# EAGLE schematic apo_board (EAGLE 6.3)
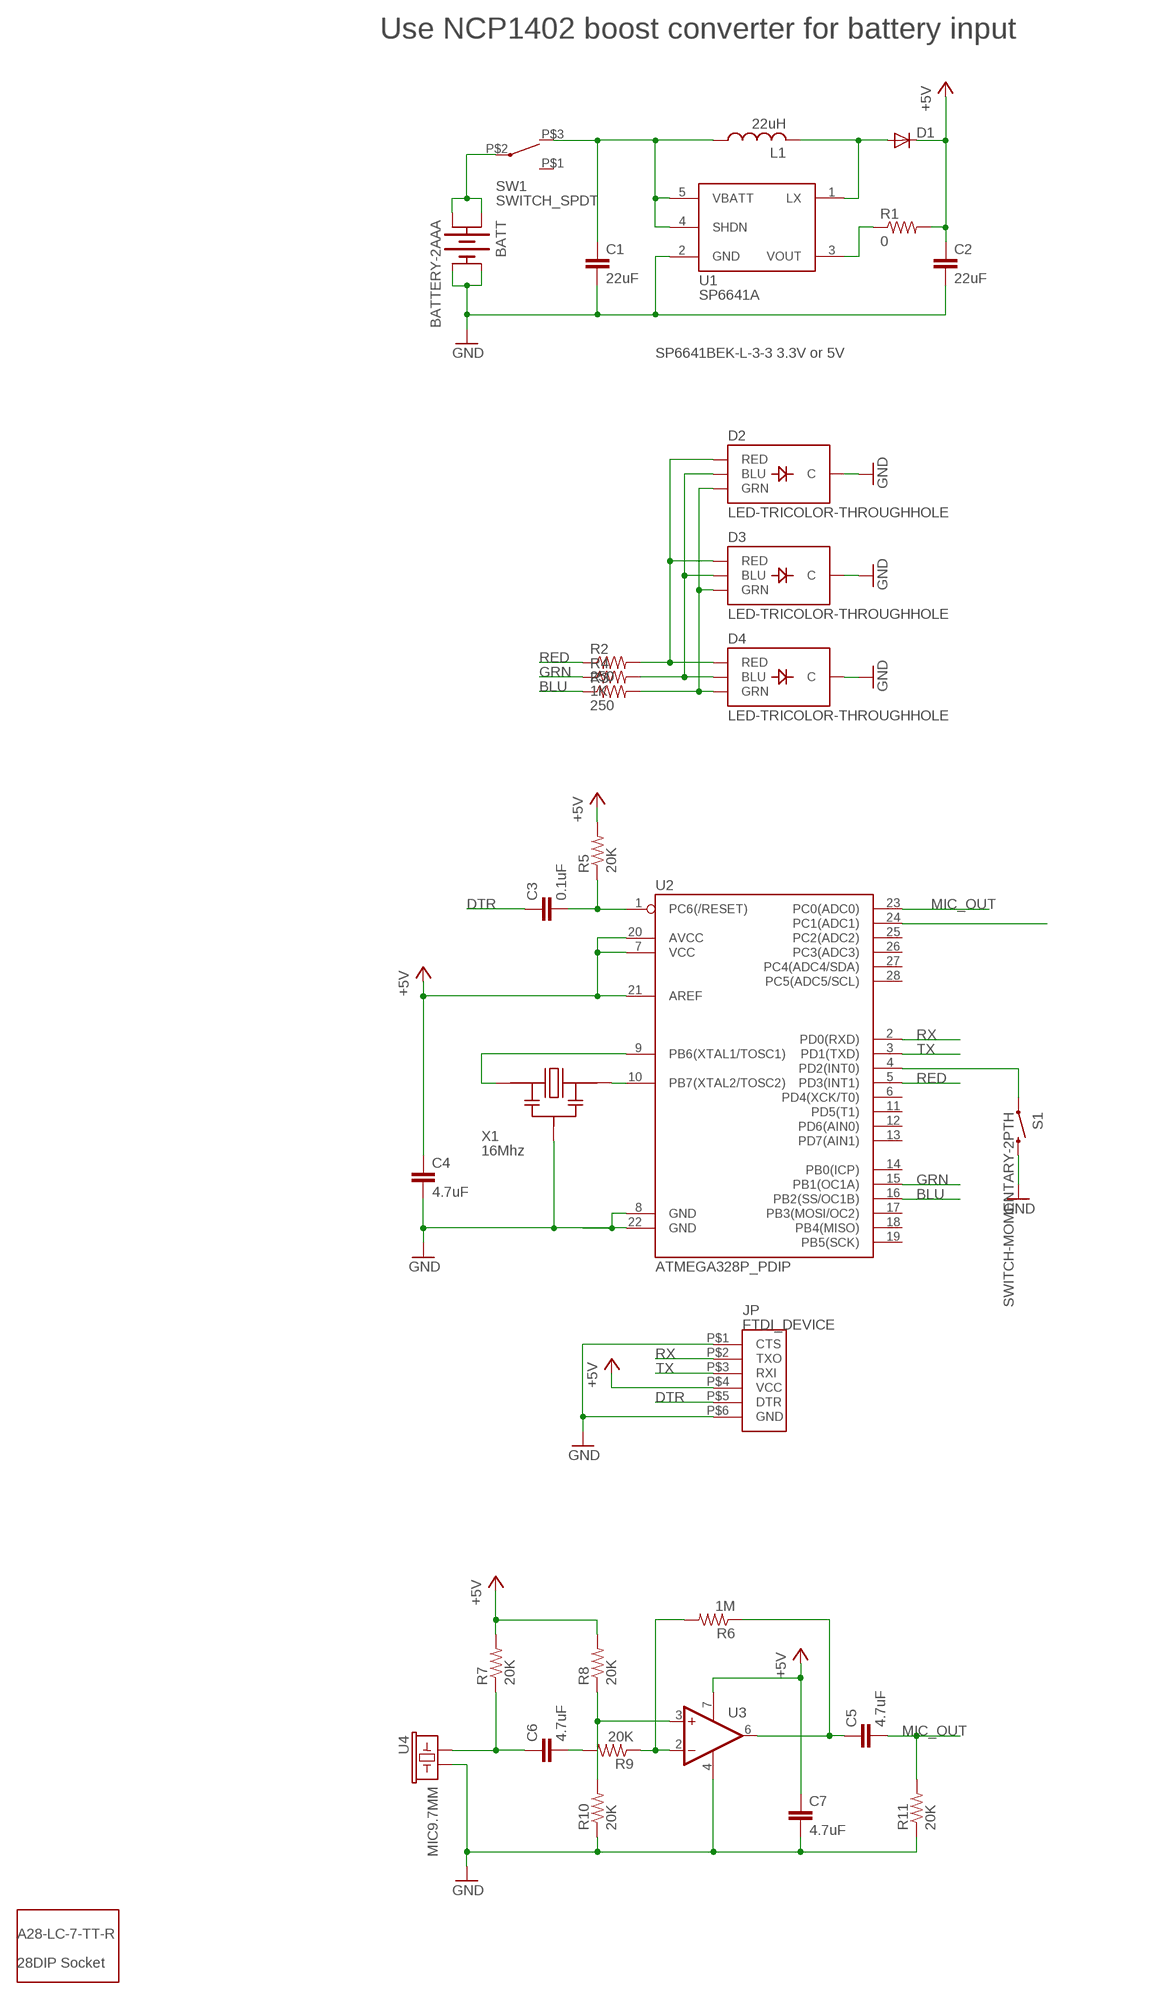
[diagram p0: schematic, sheet 1]

## Parts
BATT  BATTERY-2AAA  [BATTERY-AAA]
C1  22uF  CAPKIT  [CAP-PTH-SMALL-KIT]
C2  22uF  CAPKIT  [CAP-PTH-SMALL-KIT]
C3  0.1uF  CAPKIT  [CAP-PTH-SMALL-KIT]
C4  4.7uF  CAPKIT  [CAP-PTH-SMALL-KIT]
C5  4.7uF  CAPKIT  [CAP-PTH-SMALL-KIT]
C6  4.7uF  CAPKIT  [CAP-PTH-SMALL-KIT]
C7  4.7uF  CAPKIT  [CAP-PTH-SMALL-KIT]
D1  DIODE1N4148  [DIODE-1N4148]
D2  LED-TRICOLOR-THROUGHHOLE  [LED-TRICOLOR-THROUGHHOLE]
D3  LED-TRICOLOR-THROUGHHOLE  [LED-TRICOLOR-THROUGHHOLE]
D4  LED-TRICOLOR-THROUGHHOLE  [LED-TRICOLOR-THROUGHHOLE]
JP  FTDI_DEVICE  [FTDI_DEVICE_SIDE]
L1  22uH  INDUCTORAIUR-02H  [INDUCTOR_AIUR-02H]
R1  0  RESISTORAXIAL-0.3  [AXIAL-0.3]
R2  250  RESISTORAXIAL-0.3  [AXIAL-0.3]
R3  250  RESISTORAXIAL-0.3  [AXIAL-0.3]
R4  1K  RESISTORAXIAL-0.3  [AXIAL-0.3]
R5  20K  RESISTORAXIAL-0.3  [AXIAL-0.3]
R6  1M  RESISTORAXIAL-0.3  [AXIAL-0.3]
R7  20K  RESISTORAXIAL-0.3  [AXIAL-0.3]
R8  20K  RESISTORAXIAL-0.3  [AXIAL-0.3]
R9  20K  RESISTORAXIAL-0.3  [AXIAL-0.3]
R10  20K  RESISTORAXIAL-0.3  [AXIAL-0.3]
R11  20K  RESISTORAXIAL-0.3  [AXIAL-0.3]
S1  SWITCH-MOMENTARY-2PTH  [TACTILE-PTH]
SW1  SWITCH_SPDT  [SWITCH_SPDT_OS102011MA1QN1C]
U1  SP6641A  [SOT23-5]
U2  ATMEGA328P_PDIP  [DIL28-3]
U3  1AMP_P7+4N  [DIL08]
U4  MIC9.7MM  [MIC-9.7MM]
X1  16Mhz  CERAMIC_RESONATOR  [CERAMIC_RESONATOR_ZTT]

## Nets
+5V: C2.1 C4.1 C7.1 D1.C JP.P$4(VCC) R1.P$2 R5.P$2 R7.P$2 R8.P$2 U2.7(VCC) U2.20(AVCC) U2.21(AREF) U3.7(V+)
BATT: BATT.PWR@1(+1) BATT.PWR@2(+2) SW1.P$2(COMMON)
BLU: R3.P$1 U2.16(PB2(SS/OC1B))
DTR: C3.1 JP.P$5(DTR)
GND: BATT.GND@1(-1) BATT.GND@2(-2) C1.2 C2.2 C4.2 C7.2 D2.GND(C) D3.GND(C) D4.GND(C) JP.P$1(CTS) JP.P$6(GND) R10.P$1 R11.P$1 S1.3 U1.2(GND) U2.8(GND) U2.22(GND) U3.4(V-) U4.2 X1.P$2
GRN: R4.P$1 U2.15(PB1(OC1A))
MIC_OUT: C5.2 R11.P$2 U2.23(PC0(ADC0))
N$1: U2.9(PB6(XTAL1/TOSC1)) X1.P$1
N$2: U2.10(PB7(XTAL2/TOSC2)) X1.P$3
N$3: S1.1 U2.4(PD2(INT0))
N$4: C6.2 R9.P$2
N$5: R8.P$1 R10.P$2 U3.3(+IN)
N$6: R6.P$2 R9.P$1 U3.2(-IN)
N$7: C6.1 R7.P$1 U4.1
N$8: D2.GRN D3.GRN D4.GRN R3.P$2
N$9: D2.BLU D3.BLU D4.BLU R4.P$2
N$10: C3.2 R5.P$1 U2.1(PC6(/RESET))
N$11: C5.1 R6.P$1 U3.6(OUT)
N$12: U2.24(PC1(ADC1))
N$13: D2.RED D3.RED D4.RED R2.P$2
N$14: D1.A L1.P$2 U1.1(LX)
N$16: C1.1 L1.P$1 SW1.P$3 U1.4(SHDN) U1.5(VBATT)
N$17: R1.P$1 U1.3(VOUT)
RED: R2.P$1 U2.5(PD3(INT1))
RX: JP.P$2(TXO) U2.2(PD0(RXD))
TX: JP.P$3(RXI) U2.3(PD1(TXD))
Unconnected: SW1.P$1 U2.6(PD4(XCK/T0)) U2.11(PD5(T1)) U2.12(PD6(AIN0)) U2.13(PD7(AIN1)) U2.14(PB0(ICP)) U2.17(PB3(MOSI/OC2)) U2.18(PB4(MISO)) U2.19(PB5(SCK)) U2.25(PC2(ADC2)) U2.26(PC3(ADC3)) U2.27(PC4(ADC4/SDA)) U2.28(PC5(ADC5/SCL))

## Notes on the sheet
- Use NCP1402 boost converter for battery input
- SP6641BEK-L-3-3 3.3V or 5V

## Library data of the parts
BATT = SparkFun-Electromechanical:BATTERY-2: AA and AAA battery holders
C1-C7 = SparkFun-Passives:CAP: Capacitor Standard 0603 ceramic capacitor, and 0.1" leaded capacitor.
D1 = SparkFun-DiscreteSemi:DIODE: Diode These are standard reverse protection diodes and small signal diodes. SMA package can handle up to about 1A. SOD-323 can handle about 200mA. What the SOD-323 package when ordering, there are some mfgs out there that are 5-pin packages.
D2-D4 = SparkFun:LED-TRICOLOR-THROUGHHOLE
JP = SparkFun-Connectors:FTDI_DEVICE: Connector which mates to FTDI basic or FTDI cable.
L1 = 1_Dan Master:INDUCTOR: SMT Inductor
R1-R11 = SparkFun-Passives:RESISTOR: Resistor Basic schematic elements and footprints for 0603, 1206, and PTH resistors.
S1 = SparkFun:SWITCH-MOMENTARY-2
SW1 = 1_Dan Master:SWITCH_SPDT
U1 = 1_Dan Master:SP6641A
U2 = SparkFun-DigitalIC:ATMEGA328P_PDIP: uC used in the Arduino 32kb flash, 1k EEPROM, 2k SRAM This is the through-hole version of this chip.
U3 = linear:1AMP_P7+4: OP AMP
U4 = SparkFun:MIC: Microphone Omni-directional electret microphone. 9.7mm standard diameter.
X1 = 1_Dan Master:CERAMIC_RESONATOR